# EAGLE design seths 4layer nano (EAGLE 9.5.2)
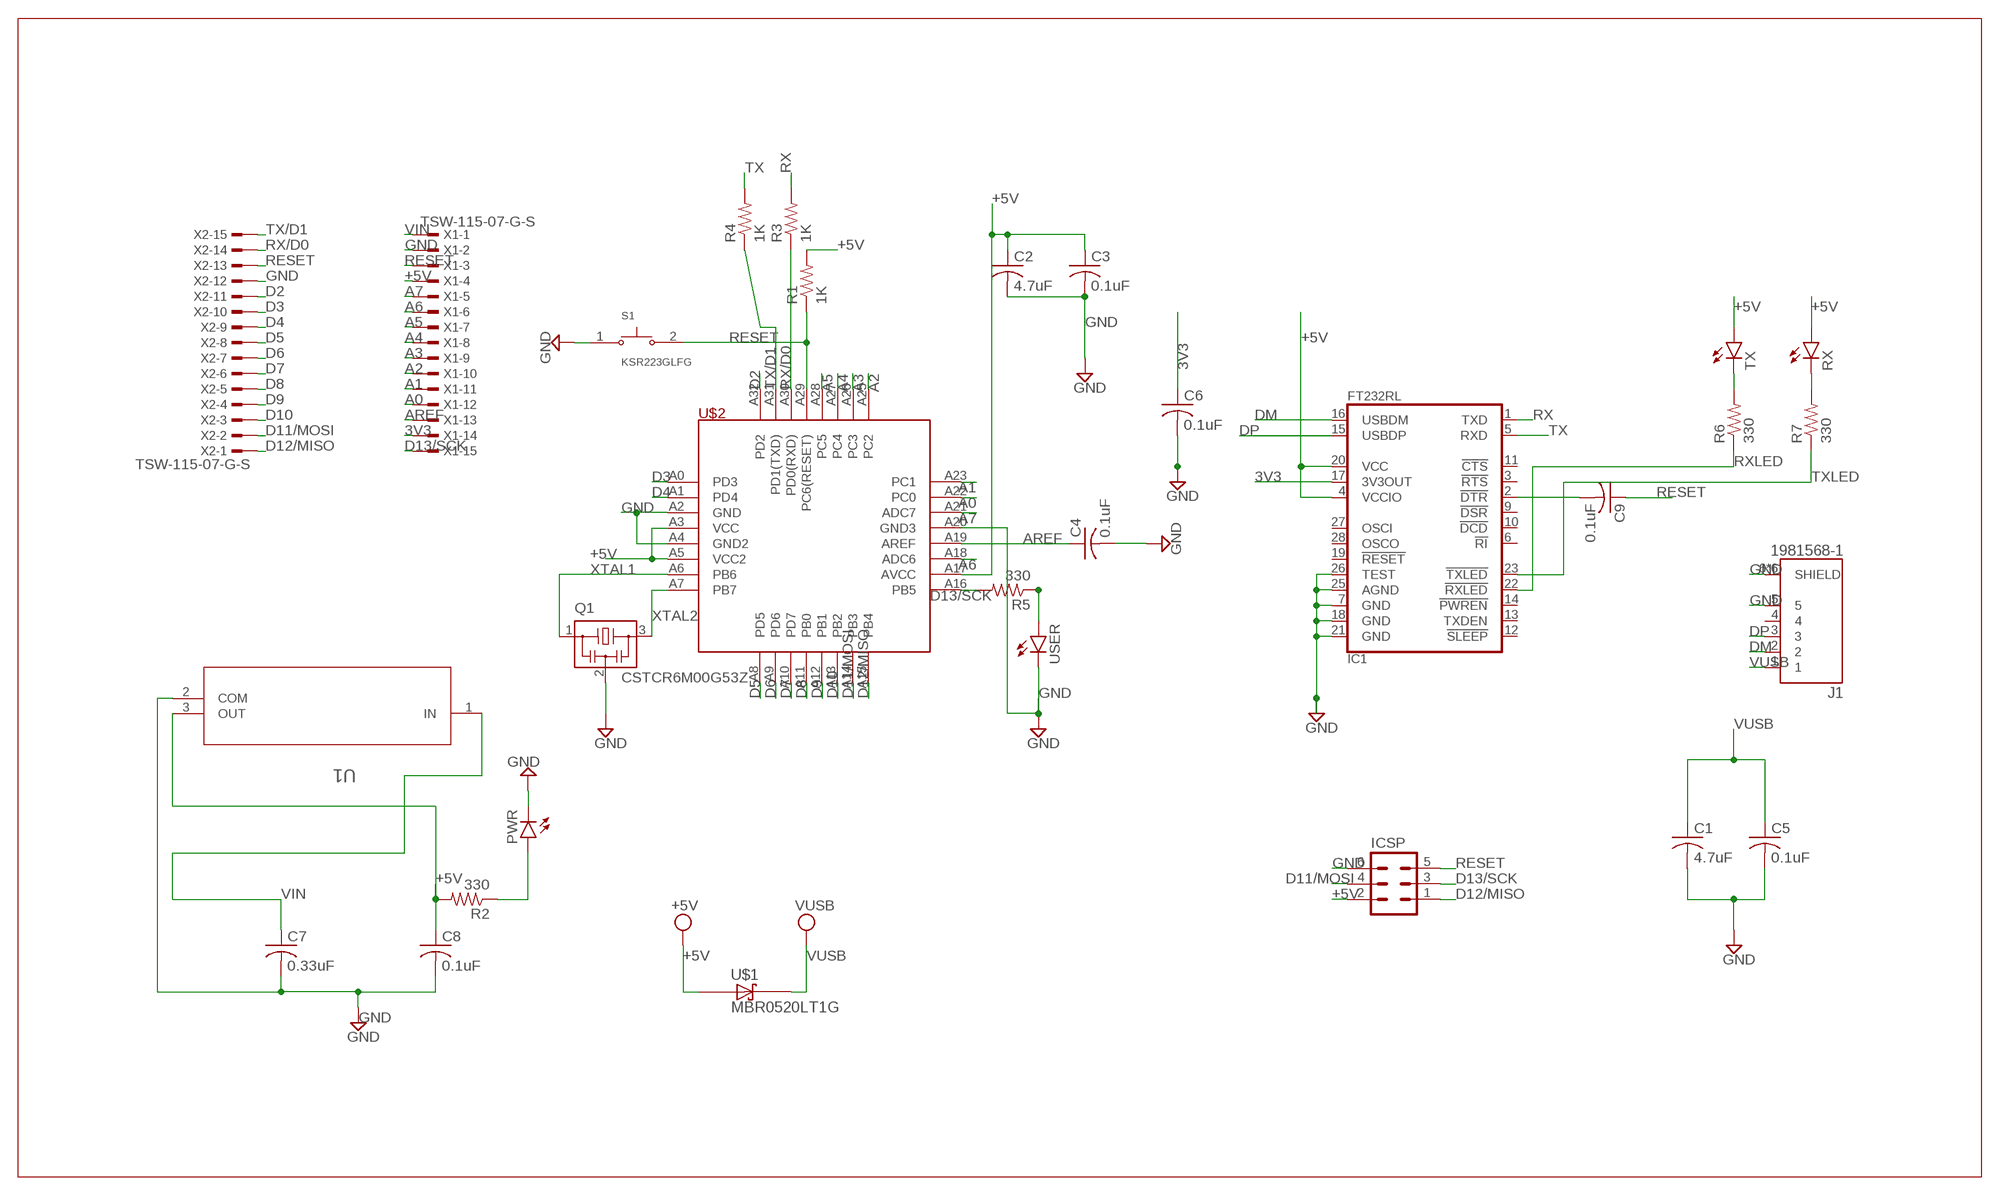
[diagram p0: schematic, sheet 1]

## Parts
C1  4.7uF  C-USC1206  [C1206]
C2  4.7uF  C-USC1206  [C1206]
C3  0.1uF  C-USC0603  [C0603]
C4  0.1uF  C-USC0603  [C0603]
C5  0.1uF  C-USC0603  [C0603]
C6  0.1uF  C-USC0603  [C0603]
C7  0.33uF  C-USC0603  [C0603]
C8  0.1uF  C-USC0603  [C0603]
C9  0.1uF  C-USC0603  [C0603]
IC1  FT232RL  [SSOP28-LD]
ICSP  MA03-2  [MA03-2]
J1  1981568-1  [TE_1981568-1]
PWR  RED_POWER  LEDCHIP-LED0603  [CHIP-LED0603]
Q1  CSTCR6M00G53Z  [CSTCR6M]
R1  1K  R-US_R0603  [R0603]
R2  330  R-US_R0603  [R0603]
R3  1K  R-US_R0603  [R0603]
R4  1K  R-US_R0603  [R0603]
R5  330  R-US_R0603  [R0603]
R6  330  R-US_R0603  [R0603]
R7  330  R-US_R0603  [R0603]
RX  RED_TX  LEDCHIP-LED0603  [CHIP-LED0603]
S1  KSR223GLFG  [SW_KSR223GLFG]
TX  RED_RX  LEDCHIP-LED0603  [CHIP-LED0603]
U1  UA78M05CDCYRDCY4-L  [DCY4-L]
U$1  MBR0520LT1G  [SOD3716X117(SOD-123)]
U$2  ATMEGA328P  [TQFP32]
USER  Amber_L  LEDCHIP-LED0603  [CHIP-LED0603]
X1  TSW-115-07-G-S  [TSW-115-XX-G-S]
X2  TSW-115-07-G-S  [TSW-115-XX-G-S]

## Nets
3V3: C6.1 IC1.17(3V3OUT) X1.14
+5V: C2.1 C3.1 C8.1 IC1.4(VCCIO) IC1.20(VCC) ICSP.2 R1.2 R2.2 RX.A TX.A U1.3(OUT) U$1.2(A) U$2.A3(VCC) U$2.A5(VCC2) U$2.A17(AVCC) X1.4
A0: U$2.A22(PC0) X1.12
A1: U$2.A23(PC1) X1.11
A2: U$2.A25(PC2) X1.10
A3: U$2.A26(PC3) X1.9
A4: U$2.A27(PC4) X1.8
A5: U$2.A28(PC5) X1.7
A6: U$2.A18(ADC6) X1.6
A7: U$2.A21(ADC7) X1.5
AREF: C4.1 U$2.A19(AREF) X1.13
D2: U$2.A32(PD2) X2.11
D3: U$2.A0(PD3) X2.10
D4: U$2.A1(PD4) X2.9
D5: U$2.A8(PD5) X2.8
D6: U$2.A9(PD6) X2.7
D7: U$2.A10(PD7) X2.6
D8: U$2.A11(PB0) X2.5
D9: U$2.A12(PB1) X2.4
D10: U$2.A13(PB2) X2.3
D11/MOSI: ICSP.4 U$2.A14(PB3) X2.2
D12/MISO: ICSP.1 U$2.A15(PB4) X2.1
D13/SCK: ICSP.3 R5.2 U$2.A16(PB5) X1.15
DM: IC1.16(USBDM) J1.2
DP: IC1.15(USBDP) J1.3
GND: C1.2 C2.2 C3.2 C4.2 C5.2 C6.2 C7.2 C8.2 IC1.7(GND) IC1.18(GND) IC1.21(GND) IC1.25(AGND) IC1.26(TEST) ICSP.6 J1.5 J1.6(SHIELD) J1.7(SHIELD) J1.8(SHIELD) J1.9(SHIELD) J1.10(SHIELD) J1.11(SHIELD) PWR.C Q1.2 S1.1 U1.2(COM) U$2.A2(GND) U$2.A4(GND2) U$2.A20(GND3) USER.C X1.2 X2.12
N$3: R5.1 USER.A
N$7: R6.2 TX.C
N$9: R7.2 RX.C
N$16: C9.2 IC1.2(!DTR)
N$26: PWR.A R2.1
RESET: C9.1 ICSP.5 R1.1 S1.2 U$2.A29(PC6(RESET)) X1.3 X2.13
RX: IC1.1(TXD) R3.2
RX/D0: R3.1 U$2.A30(PD0(RXD)) X2.14
RXLED: IC1.22(!RXLED) R6.1
TX: IC1.5(RXD) R4.2
TX/D1: R4.1 U$2.A31(PD1(TXD)) X2.15
TXLED: IC1.23(!TXLED) R7.1
VIN: C7.1 U1.1(IN) X1.1
VUSB: C1.1 C5.1 J1.1 U$1.1(C)
XTAL1: Q1.1 U$2.A6(PB6)
XTAL2: Q1.3 U$2.A7(PB7)
Unconnected: IC1.3(!RTS) IC1.6(!RI) IC1.9(!DSR) IC1.10(!DCD) IC1.11(!CTS) IC1.12(!SLEEP) IC1.13(TXDEN) IC1.14(!PWREN) IC1.19(!RESET) IC1.27(OSCI) IC1.28(OSCO) J1.4

## Library data of the parts
C1-C9 = rcl:C-US: CAPACITOR, American symbol; SPICEPREFIX: C
IC1 = FT232RL:FT232RL; AVAILABILITY: Unavailable; DESCRIPTION: USB Bridge, USB to UART USB 2.0 UART Interface 28-SSOP; MF: FTDI, Future; MP: FT232RL; PACKAGE: SSOP-28 FTDI, Future; PRICE: None
ICSP = con-lstb:MA03-2: PIN HEADER; OC_FARNELL: unknown; OC_NEWARK: unknown
J1 = 1981568-1:1981568-1: CONN RCPT MICRO USB B R/A SMD; AVAILABILITY: Unavailable; DESCRIPTION: USB - micro B USB 2.0 Receptacle Connector 5 Position Surface Mount, Right Angle; MF: TE Connectivity; MP: 19815681; PACKAGE: None; PRICE: None; TE_PURCHASE_URL: https://www.te.com/usa-en/product-19815681.html?te_bu=Cor&te_type=disp&te_campaign=seda_glo_cor-seda-global-disp-prtnr-fy19-seda-model-bom-cta_sma-317_1&elqCampaignId=32493
PWR RX TX USER = led:LED: LED OSRAM: - CHIPLED LG R971, LG N971, LY N971, LG Q971, LY Q971, LO R971, LY R971 LH N974, LH R974 LS Q976, LO Q976, LY Q976 LO Q996 - Hyper CHIPLED LW Q18S LB Q993, LB Q99A, LB R99A - SideLED LS A670, LO A670, LY A670, LG A670, LP A670 LB A673, LV A673, LT A673, LW A673 LH A674 LY A675 LS A676, LA A676, LO A676, LY A676, LW A676 LS A679, LY A679, LG A679 - Hyper Micro SIDELED® LS Y876, LA Y876, LO Y876, LY Y876 LT Y87S - SmartLED LW L88C, LW L88S LB L89C, LB L89S, LG L890 LS L89K, LO L89K, LY L89K LS L896, LA L896, LO L896, LY L896 - TOPLED LS T670, LO T670, LY T670, LG T670, LP T670 LSG T670, LSP T670, LSY T670, LOP T670, LYG T670 LG T671, LOG T671, LSG T671 LB T673, LV T673, LT T673, LW T673 LH T674 LS T676, LA T676, LO T676, LY T676, LB T676, LH T676, LSB T676, LW T676 LB T67C, LV T67C, LT T67C, LS T67K, LO T67K, LY T67K, LW E67C LS E67B, LA E67B, LO E67B, LY E67B, LB E67C, LV E67C, LT E67C LW T67C LS T679, LY T679, LG T679 LS T770, LO T770, LY T770, LG T770, LP T770 LB T773, LV T773, LT T773, LW T773 LH T774 LS E675, LA E675, LY E675, LS T675 LS T776, LA T776, LO T776, LY T776, LB T776 LHGB T686 LT T68C, LB T68C - Hyper Mini TOPLED® LB M676 - Mini TOPLED Santana® LG M470 LS M47K, LO M47K, LY M47K Source: http://www.osram.convergy.de LUXEON: - LUMILED® LXK2-PW12-R00, LXK2-PW12-S00, LXK2-PW14-U00, LXK2-PW14-V00 LXK2-PM12-R00, LXK2-PM12-S00, LXK2-PM14-U00 LXK2-PE12-Q00, LXK2-PE12-R00, LXK2-PE12-S00, LXK2-PE14-T00, LXK2-PE14-U00 LXK2-PB12-K00, LXK2-PB12-L00, LXK2-PB12-M00, LXK2-PB14-N00, LXK2-PB14-P00, LXK2-PB14-Q00 LXK2-PR12-L00, LXK2-PR12-M00, LXK2-PR14-Q00, LXK2-PR14-R00 LXK2-PD12-Q00, LXK2-PD12-R00, LXK2-PD12-S00 LXK2-PH12-R00, LXK2-PH12-S00 LXK2-PL12-P00, LXK2-PL12-Q00, LXK2-PL12-R00 Source: www.luxeon.com KINGBRIGHT: KA-3528ASYC Source: www.kingbright.com
Q1 = murata-filter:CSTCR: Resonator Source: murata.co.jp; MPN: CSTCR6M00G53-R0; OC_FARNELL: 1170434; OC_NEWARK: 25M8759
R1-R7 = rcl:R-US_: RESISTOR, American symbol; SPICEPREFIX: R
S1 = KSR223GLFG:KSR223GLFG: Switch Tactile N.O. SPST Round Button Gull Wing 0.01A 32VDC 0.2VA 200000Cycles 2N SMD Automotive T/R; AVAILABILITY: Unavailable; DESCRIPTION: Tactile Switch SPST-NO Top Actuated Surface Mount; MF: C&K; MP: KSR223GLFG; PACKAGE: None; PRICE: None
U1 = UA78M05CDCYR:UA78M05CDCYR; BUILT_BY: EMA_UL_Team; MANUFACTURER_PART_NUMBER: UA78M05CDCYR; VENDOR: Texas Instruments
U$1 = MBR0520LT1G:MBR0520LT1G: Surface Mount Schottky Power Rectifier Plastic SOD−123 Package; AVAILABILITY: Unavailable; DESCRIPTION: Diode Schottky 20V 500mA Surface Mount SOD-123; MF: ON Semiconductor; MP: MBR0520LT1G; PACKAGE: SOD-123 ON Semiconductor; PRICE: None
U$2 = ATMega328p:ATMEGA328P
X1 X2 = con-samtec:TSW-115-*-G-S: THROUGH-HOLE .025" SQ POST HEADER Source: Samtec TSW.pdf; MF: Samtec Inc.; MPN: TSW-115-07-G-S

## Board
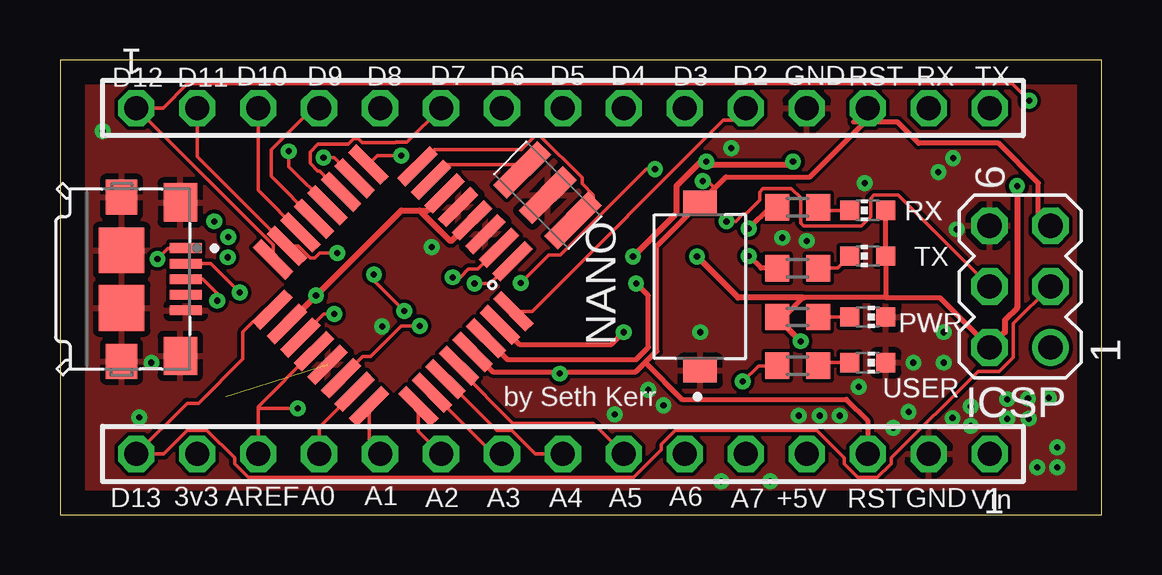
[diagram p1: board, top side]
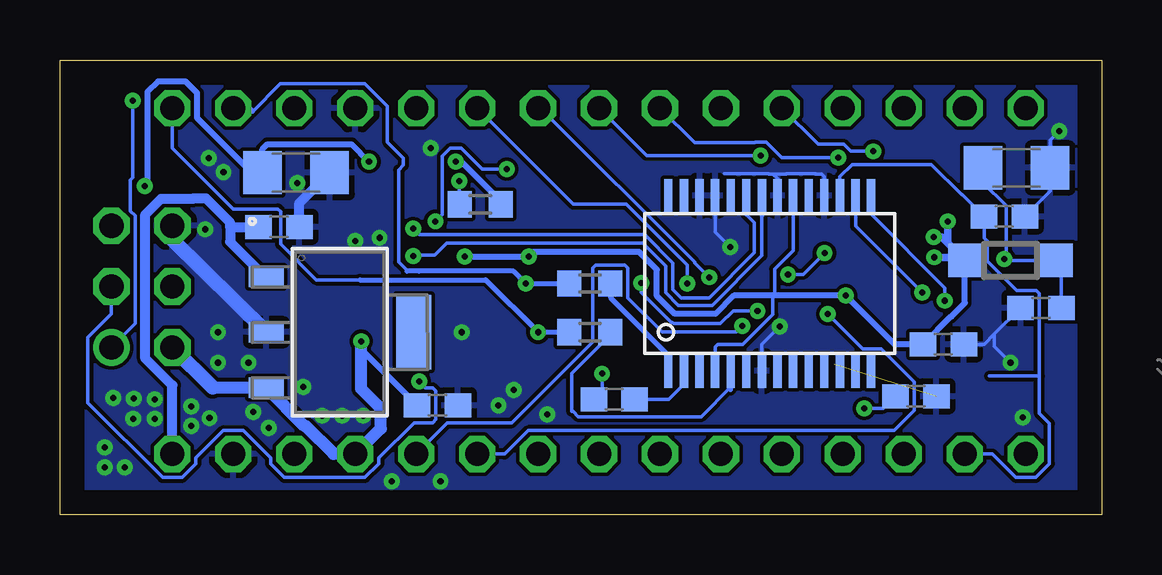
[diagram p2: board, bottom side, seen from below]

Size 43.41 x 18.97 mm. Coordinates in mm from the lower left corner, seen from the top.
Outline: 0,0 43.41,0 43.41,18.97 0,18.97 0,0
Copper layers (1*16): Top 0.035mm / dielectric 1.5mm / Bottom 0.035mm
Design rules "default *": minimum track width 6mil, minimum drill 10mil, track to track 6mil, track to pad 6mil, pad to pad 6mil, via to via 6mil, smd to smd 6mil, copper to edge 40mil, drill to drill 6mil, minimum pad ring 10mil, minimum via ring 8mil, stop-mask expansion 4mil, vias tented up to drill 35mil, thermal gap 10mil

### Footprints (pad centres in the part's own frame; a part is rotated, then mirrored left to right if it is on the bottom)
C1206 = smd 1.6 x 1.8: 1 -1.4,0; 2 1.4,0
C0603 = smd 1.1 x 1: 1 -0.85,0; 2 0.85,0
SSOP28-LD = smd 0.348 x 1.397: 1 -4.225,-3.656; 2 -3.575,-3.656; 3 -2.925,-3.656; 4 -2.275,-3.656; 5 -1.625,-3.656; 6 -0.975,-3.656; 7 -0.325,-3.656; 8 0.325,-3.656; 9 0.975,-3.656; 10 1.625,-3.656; 11 2.275,-3.656; 12 2.925,-3.656; 13 3.575,-3.656; 14 4.225,-3.656; 15 4.225,3.656; 16 3.575,3.656; 17 2.925,3.656; 18 2.275,3.656; 19 1.625,3.656; 20 0.975,3.656; 21 0.325,3.656; 22 -0.325,3.656; 23 -0.975,3.656; 24 -1.625,3.656; 25 -2.275,3.656; 26 -2.925,3.656; 27 -3.575,3.656; 28 -4.225,3.656
MA03-2 = drill 1.016: 1 -2.54,-1.27 | drill 1.016 octagon: 2 -2.54,1.27; 3 0,-1.27; 4 0,1.27; 5 2.54,-1.27; 6 2.54,1.27
TE_1981568-1 = smd 0.4 x 1.35: 1 -1.3,2.675; 2 -0.65,2.675; 3 0,2.675; 4 0.65,2.675; 5 1.3,2.675 | smd 1.6 x 1.4: 6 -3.2,2.45; 7 3.2,2.45 | smd 1.45 x 1.3: 8 3.425,0; 9 -3.425,0 | smd 1.9 x 1.9: 10 -1.2,0; 11 1.2,0
CHIP-LED0603 = smd 0.8 x 0.8: A 0,-0.75; C 0,0.75
CSTCR6M = smd 0.8 x 2.6: 1 -1.5,0; 2 0,0; 3 1.5,0
R0603 = smd 1 x 1.1: 1 -0.85,0; 2 0.85,0
SW_KSR223GLFG = smd 1 x 1.4: 1 -3.5,0; 2 3.5,0
DCY4-L = smd 0.838 x 1.46: 1 -2.311,-3.067; 2 0,-3.067; 3 2.311,-3.067 | smd 3.099 x 1.46: 4 0,3.067
SOD3716X117(SOD-123) = smd 1.4 x 1.4: 1 -1.9,0.051; 2 1.9,0.051
TQFP32 = smd 1.905 x 0.483: A0 -4.2,6.3; A1 -4.2,5.5; A2 -4.2,4.7; A3 -4.2,3.9; A4 -4.2,3.1; A5 -4.2,2.3; A6 -4.2,1.5; A7 -4.2,0.7; A16 4.3,0.65; A17 4.3,1.5; A18 4.3,2.3; A19 4.3,3.1; A20 4.3,3.9; A21 4.3,4.7; A22 4.3,5.5; A23 4.3,6.35 | smd 0.483 x 1.905: A8 -2.8,-0.8; A9 -2,-0.8; A10 -1.2,-0.8; A11 -0.4,-0.8; A12 0.4,-0.8; A13 1.2,-0.8; A14 2,-0.8; A15 2.8,-0.8; A25 2.85,7.8; A26 2.05,7.8; A27 1.25,7.8; A28 0.45,7.8; A29 -0.35,7.8; A30 -1.15,7.8; A31 -1.95,7.8; A32 -2.75,7.8
TSW-115-XX-G-S = drill 1 pad 1.5 octagon: 1 17.78,0; 2 15.24,0; 3 12.7,0; 4 10.16,0; 5 7.62,0; 6 5.08,0; 7 2.54,0; 8 0,0; 9 -2.54,0; 10 -5.08,0; 11 -7.62,0; 12 -10.16,0; 13 -12.7,0; 14 -15.24,0; 15 -17.78,0

### Placement (x,y rotation side)
C1  3.56,14.48 0 bottom
C2  33.58,14.27 0 bottom
C3  27.69,4.57 0 bottom
C4  7.75,4.95 0 bottom
C5  2.54,8.64 180 bottom
C6  4.06,12.45 0 bottom
C7  34.29,12.01 0 bottom
C8  6.6,7.11 0 bottom
C9  20.32,4.83 0 bottom
IC1  13.84,9.65 0 bottom
ICSP  40.01,9.53 90 top
J1  2.57,9.83 270 top
PWR  33.66,8.26 270 top
Q1  20.32,13.34 315 top
R1  25.91,12.95 0 bottom
R2  30.73,8.26 180 top
R3  21.34,9.65 0 bottom
R4  21.34,7.62 0 bottom
R5  30.73,6.22 180 top
R6  30.73,10.29 0 top
R7  30.73,12.83 0 top
RX  33.66,12.7 90 top
S1  26.67,9.53 90 top
TX  33.66,10.79 90 top
U1  31.75,7.62 270 bottom
U$1  3.81,10.67 180 bottom
U$2  11.43,12.06 225 top
USER  33.66,6.35 270 top
X1  20.95,2.54 0 top
X2  20.95,16.97 180 top

### Tracks (layer width: path | path; a pad name or v marks a point on that pad's centre or on a via)
3V3
  Bottom 0.152: IC1.17 10.92,14.1 10.41,14.61 7.11,14.61 5.85,13.35 5.82,13.35 C6.1 4.91,11.54 4.78,11.41 4.78,10.6 3.55,9.37 2.75,9.37 2.61,9.23 2.61,5.79 | X1.14 4.57,2.54 3.58,1.56 2.77,1.56 2.19,2.13 2.19,3.81 2.61,4.23 2.61,5.79 | 4.68,5.79 2.61,5.79
+5V  (via drill 0.25)
  Top 0.203: R2.2 30.18,8.26 30.98,9.06 34.42,9.06 | 34.42,9.06 36.66,9.06 ICSP.2 | 34.42,9.06 TX.A RX.A
  Top 0.254: v39.88,13.72 39.88,8.63 39.37,8.12 39.37,7.62 ICSP.2 | U$2.A17 9.49,7.96 v10.67,9.14 14.22,12.7 14.99,12.7 | U$2.A5 15.32,12.7 14.99,12.7 | U$2.A3 16.31,11.43 16.26,11.43 14.99,12.7 | v23.88,10.78 25.69,12.6 25.69,13.73 26.7,14.73 v26.92,14.73 27.1,14.58 30.39,14.58 v30.54,14.73 | v30.86,7.24 29.88,8.22 R2.2 | 30.98,9.06 28.25,9.06 v26.54,10.77
  Bottom 0.152: IC1.4 16.12,7 16,7.11 14.96,7.11 13.72,8.35 13.72,9.14 13.64,9.22 13.64,10.26 12.87,11.04 IC1.20
  Bottom 0.254: v39.88,13.72 39.77,13.83 39.77,17.65 39.34,18.08 38.18,18.08 37.7,17.6 37.7,16.55 35.42,14.28 C2.1 34.98,15.25 34.77,15.45 31.26,15.45 v30.54,14.73 | U$1.2 5.71,8.84 6.27,8.28 6.29,8.28 C8.1 8.64,7.11 v10.67,9.14 13.72,9.14 15.34,9.14 16.09,8.38 17.8,8.38 18.54,9.13 18.54,10.23 19.28,10.97 23.69,10.97 v23.88,10.78 v23.89,10.77 v26.54,10.77 | v26.92,14.73 26.7,14.73 25.06,13.1 R1.2 | C3.1 30.86,6.9 v30.86,7.24 | 32.1,2.54 X1.4
  Bottom 0.305: U$1.2 5.84,10.74 v6.99,10.74 | U$1.2 6.67,11.58 v7.01,11.58 | U$1.2 6.43,11.33 v6.43,12.24
  Bottom 0.508: 37.06,5.31 U1.3 33.21,3.7 33.17,3.7 32.01,2.54 X1.4 30.05,3.61 30.05,4.45 30.86,5.26 v30.86,7.24
  Bottom 0.61: ICSP.2 37.06,5.31
A0
  Top 0.152: U$2.A22 10.79,3.65 X1.12
A1
  Top 0.152: U$2.A23 12.88,3 X1.11
A2
  Top 0.152: U$2.A25 14.93,3.48 X1.10
A3
  Top 0.152: U$2.A26 18.06,2.54 X1.9
A4
  Top 0.152: U$2.A27 18.2,3.52 18.82,3.52 19.8,2.54 X1.8
A5
  Top 0.152: U$2.A28 16.63,6.06 18.87,3.82 22.22,3.82 X1.7
A6  (via drill 0.25)
  Top 0.152: U$2.A18 11,8.38 v11.43,8.38
  Bottom 0.152: X1.6 24.89,2.54 23.9,3.52 8.65,3.52 7.82,4.36 7.82,5.55 9.19,6.92 9.97,6.92 v11.43,8.38
A7  (via drill 0.25)
  Top 0.152: v14.99,7.87 14.22,7.87 12.95,6.6 12.62,6.6 U$2.A21
  Bottom 0.152: X1.5 27.27,3.84 24.59,3.84 21.21,7.22 21.21,10.3 21.08,10.43 19.89,10.43 19.76,10.3 19.76,9.05 18.32,7.62 15.24,7.62 v14.99,7.87
AREF  (via drill 0.25)
  Top 0.152: U$2.A19 8.26,4.51 | 8.26,4.51 X1.13 | 8.26,4.51 8.32,4.45 v9.91,4.45
  Bottom 0.152: v9.91,4.45 9.11,4.45 C4.1
D2
  Top 0.152: U$2.A32 19.68,8.49 27.64,16.46 28.07,16.46 X2.11
D3  (via drill 0.25)
  Top 0.152: U$2.A0 17.93,9.65 v17.27,9.65
  Bottom 0.152: X2.10 22.02,12.95 19.81,12.95 17.27,10.41 v17.27,9.65
D4  (via drill 0.25)
  Top 0.152: 23.5,16.81 X2.9 | U$2.A1 17.4,10.26 17.02,10.26 16.67,9.91 v16.36,9.91
  Bottom 0.152: v16.36,9.91 16.97,10.51 16.97,10.54 23.39,16.97 X2.9
D5  (via drill 0.25)
  Top 0.152: U$2.A8 13.22,14.99 v14.22,14.99
  Bottom 0.152: X2.8 18.97,14.99 v14.22,14.99
D6  (via drill 0.25)
  Top 0.152: v10.98,14.9 11.43,14.9 U$2.A9
  Bottom 0.152: v10.98,14.9 13.34,14.9 13.99,15.54 14.46,15.54 14.47,15.53 16.98,15.53 X2.7
D7
  Top 0.152: 11.67,13.48 11.68,13.48 | 11.68,13.48 U$2.A10 | X2.6 14.45,15.54 13.99,15.54 13.97,15.53 12.59,15.53 12.44,15.68 12.25,15.68 12.02,15.46 10.75,15.46 10.42,15.13 10.42,14.66 10.75,14.34 10.83,14.34 11.68,13.48
D8  (via drill 0.25)
  Top 0.152: U$2.A11 9.53,14.54 v9.53,15.16
  Bottom 0.152: v9.53,15.16 10.46,15.16 10.75,15.46 11.82,15.46 X2.5
D9
  Top 0.152: U$2.A12 8.8,14.12 8.8,15.23 10.54,16.97 X2.4
D10
  Top 0.152: U$2.A13 8.26,13.54 X2.3
D11/MOSI  (via drill 0.25)
  Top 0.152: X2.2 5.71,14.95 U$2.A14 9.92,11.22 10.42,10.71 10.61,10.71 10.83,10.92 v11.56,10.92 | v13.08,10.03 13.08,9.78 v14.35,8.51 | v19.2,9.68 20.36,10.84 20.84,10.84 24.42,14.43 v24.79,14.43 | v27.77,12.24 28.15,12.24 28.45,12.54 28.57,12.54 29.16,13.12 29.16,13.47 29.29,13.61 30.48,13.61 30.86,13.23 30.86,12.18 30.99,12.05 33.38,12.05 33.78,12.45 33.78,13.2 33.91,13.33 34.93,13.33 ICSP.4
  Bottom 0.152: v11.56,10.92 12.45,10.03 v13.08,10.03 | v14.35,8.51 15.37,8.51 15.9,7.98 17.84,7.98 17.89,8.03 17.94,8.03 19.2,9.28 v19.2,9.68 | v27.77,12.24 27.49,12.53 27.49,14.96 27.16,15.29 26.69,15.29 25.83,14.43 v24.79,14.43
D12/MISO  (via drill 0.25)
  Top 0.152: U$2.A15 8.88,11.26 X2.1 4.3,16.97 5.31,17.98 39.67,17.98 40.38,17.27 v40.39,17.27
  Bottom 0.152: v40.39,17.27 40.39,14.07 40.48,13.97 40.48,12.68 40.28,12.47 40.28,7.98 ICSP.1
D13/SCK  (via drill 0.25)
  Top 0.152: U$2.A16 8.56,8.56 7.62,7.62 7.62,6.5 5.79,4.66 5.3,4.66 X1.15 4.33,2.54 5.31,3.52 6.12,3.52 7.27,2.37 7.27,2.13 7.85,1.56 23.9,1.56 25.05,2.71 25.05,2.95 25.63,3.52 31.52,3.52 32.67,2.37 32.67,2.13 33.25,1.56 34.06,1.56 34.64,2.13 34.64,2.37 38.26,5.99 39.15,5.99 39.73,6.58 39.73,7.98 ICSP.3 | v28.45,5.56 29.11,6.22 R5.2
  Bottom 0.152: v28.45,5.56 28.19,5.3 27.89,5.3 27.76,5.17 27.76,3.98 27.89,3.84 28.66,3.84 30.13,2.37 30.13,2.13 30.71,1.56 34.06,1.56 34.64,2.13 34.64,2.37 35.79,3.52 36.6,3.52 37.75,2.37 37.75,2.13 38.33,1.56 39.14,1.56 42.27,4.68 42.27,7.39 41.27,8.39 ICSP.3
DM  (via drill 0.25)
  Top 0.152: J1.2 6.28,10.48 v7.49,9.27
  Bottom 0.152: v7.49,9.27 10.27,12.05 IC1.16
DP  (via drill 0.25)
  Top 0.152: v6.55,8.93 6.55,9.24 5.95,9.83 J1.3
  Bottom 0.152: IC1.15 9.62,12.55 6.55,9.47 v6.55,8.93
GND  (via drill 0.25)  (1 unrouted)
  Bottom 0.152: C5.2 4.49,7.54 | 4.49,7.54 4.91,7.11 C8.2 | 4.49,7.54 4.49,7.03 v3.81,6.35 | C6.2 2.16,13.5 C1.2 2.16,15.62 v1.78,16 | IC1.25 16.12,11.8 v15.49,11.18 | 13.72,14.22 13.89,14.22 13.9,14.23 15.74,14.23 | 13.72,14.22 13.52,14.03 IC1.21 | 13.72,14.22 13.15,14.22 13.14,14.23 11.95,14.23 11.94,14.22 11.68,14.22 11.57,14.11 IC1.18 | IC1.7 14.17,7.11 v13.42,7.86
  Bottom 0.406: C7.2 33.44,13.01 C2.2
  Bottom 0.61: U1.2 38.73,11.49 ICSP.6
  other vias: 3.3,4.06 36.83,7.62 36.83,6.35 35.56,6.35 26.67,7.62 29.59,1.4 27.56,1.4 33.27,5.33 23.11,4.19 24.51,5.21 25.15,4.57 33.53,13.84 31.11,11.43 30.1,11.56 37.21,14.88 36.6,14.3 39.47,4.01 39.47,4.83 40.34,4.85 41.2,4.88 40.36,4.01 41.55,2.82 41.55,1.98 40.72,1.98 34.72,3.63 35.36,4.29 37.19,4.04 37.95,3.71 37.95,4.52 37.36,11.91 32.49,4.14 31.65,4.14 30.78,4.14 27.97,15.29
  pour Top: 0,19.84 43.36,19.84 43.36,-0.38 0,-0.38
  pour Bottom: 43.18,19.05 0,19.05 0,-0.13 43.18,-0.13
N$3
  Top 0.152: USER.A 31.71,6.35 R5.1
N$7
  Top 0.152: TX.C 32.4,10.29 R6.2
N$9
  Top 0.152: RX.C 31.71,12.7 R7.2
N$16
  Bottom 0.152: IC1.2 17.41,5.46 18.04,4.83 C9.2
N$26
  Top 0.152: PWR.A R2.1
RESET  (via drill 0.25)
  Top 0.152: v20.83,5.89 20.83,5.97 | v26.77,13.92 27,13.92 27.28,13.64
  Top 0.203: U$2.A29 18.02,5.97 20.83,5.97 24,5.97 24.38,6.35 | 24.38,6.35 24.87,6.84 24.87,11.22 S1.2 27.28,13.64 27.74,14.1 31.24,14.1 33.53,16.38 | 24.38,6.35 25.9,4.83 32.77,4.83 33.66,3.94 X1.3 | X2.13 33.07,16.38 33.53,16.38 | ICSP.5 40.77,12.57 40.77,13.84 39.11,15.5 35.78,15.5 34.9,16.38 33.53,16.38
  Bottom 0.152: C9.1 20.83,5.17 v20.83,5.89 | R1.1 26.77,12.97 v26.77,13.92
RX
  Bottom 0.203: R3.2 20.49,9.07 18.07,6.65 IC1.1
RX/D0  (via drill 0.25)
  Top 0.203: U$2.A30 18.64,6.48 24,6.48 24.51,6.99 24.51,9.14 v24,9.65
  Bottom 0.152: 28.45,10.16 28.47,10.19 28.95,10.19 29.31,10.54 29.31,14.38 29.11,14.59 29.11,14.88 29.78,15.55 29.78,17.04 30.71,17.98 34.24,17.98 35.39,16.82
  Bottom 0.203: R3.1 v24,9.65 24.51,10.16 28.45,10.16 28.96,10.16 | X2.14 35.54,16.97 35.39,16.82
RXLED  (via drill 0.25)
  Top 0.203: R6.1 29.21,10.29 v28.7,10.79
  Bottom 0.152: 14.17,12.5 14.17,10.81 16.24,8.74 17.65,8.74 18.18,9.27 18.18,10.39 19.14,11.34 27.31,11.34 27.8,10.85 28.65,10.85 v28.7,10.79
  Bottom 0.203: IC1.22 14.17,12.5
TX
  Bottom 0.152: 15.47,5.33 16.7,4.1 21.82,4.1 22.04,4.32 22.1,4.32 22.1,5.9 20.91,7.09 20.91,7.2 R4.2
  Bottom 0.203: 15.47,5.23 15.47,5.33 IC1.5
TX/D1  (via drill 0.25)
  Top 0.203: U$2.A31 19.14,7.11 22.99,7.11 v23.5,7.62
  Bottom 0.152: X2.15 38.73,15.3 36.2,12.77 34.34,12.77 34.22,12.64 34.22,11.29 | 30.92,9.81 32.73,9.81 34.22,11.29 | 34.22,11.29
  Bottom 0.203: R4.1 v23.5,7.62 25.68,9.81 30.92,9.81
TXLED  (via drill 0.25)
  Top 0.203: R7.1 29.59,12.83 v28.7,11.94
  Bottom 0.152: v28.7,11.94 28.45,11.68 19.05,11.68 17.88,10.51 17.88,9.4 17.52,9.04 16.37,9.04 14.48,10.94 14.48,12.19 14.82,12.53 14.82,12.55
  Bottom 0.203: IC1.23 14.82,12.55
VIN
  Bottom 0.406: X1.1 38.73,5.4 39.85,6.52 39.85,12.53 39.2,13.18 37.87,13.18 37.85,13.21 37.34,13.21 36.32,12.19 36.32,12.01 | 36.32,12.01 C7.1 | 36.32,12.01 36.32,11.39 34.87,9.93 U1.1
VUSB  (via drill 0.25)
  Top 0.152: v4.06,10.67 4.5,11.1 4.55,11.1 4.58,11.13 J1.1
  Bottom 0.152: C5.1 1.69,10.4 U$1.1 4.01,10.62 v4.06,10.67 3.99,10.74 3.99,12.9 4.96,13.86 C1.1
XTAL1
  Top 0.152: U$2.A6 16.09,14.61 19.05,14.61 Q1.1
XTAL2
  Top 0.152: U$2.A7 15.6,15.24 19.21,15.24 19.8,15.83 19.99,15.83 21.75,14.07 21.75,13.81 22.23,13.34 22.23,13.12 Q1.3

### Text on the board
tNames: D12 | D11 | D10 | D9 | D8 | D7 | D6 | D5 | D4 | D3 | D2 | GND | RST | RX | TX | TX | NANO | by Seth Kerr | D13 | 3v3 | AREF | A0 | A1 | A2 | A3 | A4 | A5 | A6 | A7 | +5V | RST | GND | Vin
_tNames: RX | PWR | USER | ICSP